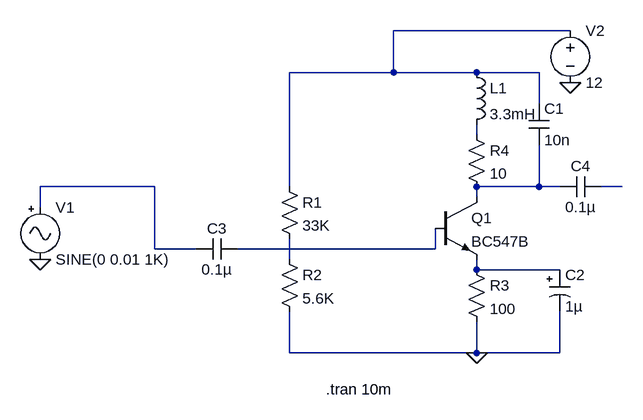
[diagram p0: schematic tuned amplifier.asc]
tuned amplifier.asc, the LTspice schematic file:
Version 4
SHEET 1 880 680
WIRE 736 16 464 16
WIRE 464 80 464 16
WIRE 464 80 304 80
WIRE 592 80 464 80
WIRE 688 80 592 80
WIRE 688 128 688 80
WIRE 592 176 592 160
WIRE 96 256 -80 256
WIRE 304 256 304 80
WIRE 688 256 688 192
WIRE 688 256 592 256
WIRE 720 256 688 256
WIRE 816 256 784 256
WIRE 592 272 592 256
WIRE -80 288 -80 256
WIRE 96 352 96 256
WIRE 160 352 96 352
WIRE 528 352 528 320
WIRE 528 352 224 352
WIRE 304 368 304 336
WIRE 592 384 592 368
WIRE 720 384 592 384
WIRE 304 512 304 448
WIRE 592 512 592 464
WIRE 592 512 304 512
WIRE 720 512 720 448
WIRE 720 512 592 512
FLAG 592 512 0
FLAG -80 368 0
FLAG 736 96 0
SYMBOL res 288 240 R0
SYMATTR InstName R1
SYMATTR Value 33K
SYMBOL res 288 352 R0
SYMATTR InstName R2
SYMATTR Value 5.6K
SYMBOL res 576 368 R0
SYMATTR InstName R3
SYMATTR Value 100
SYMBOL res 576 160 R0
SYMATTR InstName R4
SYMATTR Value 10
SYMBOL ind 576 64 R0
SYMATTR InstName L1
SYMATTR Value 3.3mH
SYMBOL polcap 704 384 R0
WINDOW 3 24 56 Left 2
SYMATTR Value 1µ
SYMATTR InstName C2
SYMATTR Description Capacitor
SYMATTR Type cap
SYMATTR SpiceLine V=X Lser=0 mfg="   ---" pn="   ---" type="   ---"
SYMBOL cap 224 336 R90
WINDOW 0 0 32 VBottom 2
WINDOW 3 32 32 VTop 2
SYMATTR InstName C3
SYMATTR Value 0.1µ
SYMATTR SpiceLine Lser=0 mfg="   ---" pn="   ---" type="   ---"
SYMBOL Misc/signal -80 272 R0
SYMATTR InstName V1
SYMATTR Value SINE(0 0.01 1K)
SYMATTR Value2 AC 10mV
SYMBOL voltage 736 0 R0
SYMATTR InstName V2
SYMATTR Value 12
SYMBOL npn2 528 272 R0
SYMATTR InstName Q1
SYMATTR Value BC547B
SYMBOL cap 672 128 R0
SYMATTR InstName C1
SYMATTR Value 10n
SYMBOL cap 784 240 R90
WINDOW 0 0 32 VBottom 2
WINDOW 3 32 32 VTop 2
SYMATTR InstName C4
SYMATTR Value 0.1µ
TEXT 360 568 Left 2 !.tran 10m

The netlist it stands for:
* tuned amplifier.asc
R1 N001 N007 33K
R2 N007 0 5.6K
R3 N008 0 100
R4 N002 N004 10
L1 N001 N002 3.3mH
C2 N008 0 1µ V=X Lser=0 mfg="   ---" pn="   ---" type="   ---"
C3 N006 N003 0.1µ Lser=0 mfg="   ---" pn="   ---" type="   ---"
V1 N003 0 SINE(0 0.01 1K) AC 10mV
V2 N001 0 12
Q1 N004 N006 N008 0 BC547B
C1 N001 N004 10n
C4 N005 N004 0.1µ
.model NPN NPN
.model PNP PNP
.lib standard.bjt
.tran 10m
.backanno
.end